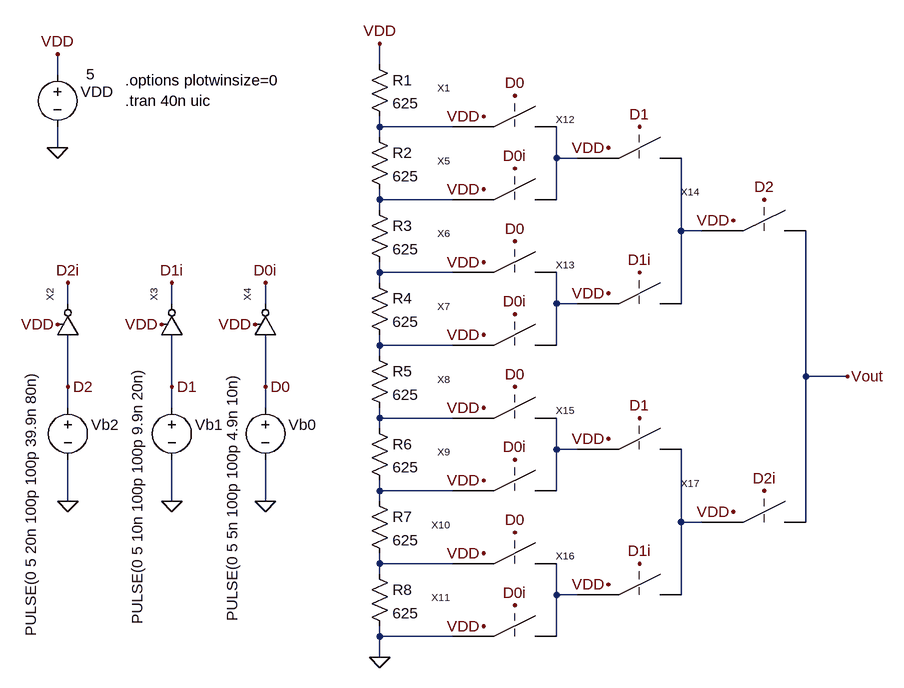
[diagram p0: schematic Fig29_3.asc]
Fig29_3.asc, the LTspice schematic file:
Version 4
SHEET 1 1608 932
WIRE 816 0 816 -32
WIRE 320 16 320 -16
WIRE 816 96 816 80
WIRE 928 96 816 96
WIRE 816 112 816 96
WIRE 320 128 320 96
WIRE 1088 144 1088 96
WIRE 1120 144 1088 144
WIRE 816 208 816 192
WIRE 928 208 816 208
WIRE 1088 208 1088 144
WIRE 816 224 816 208
WIRE 1280 256 1280 144
WIRE 1312 256 1280 256
WIRE 816 320 816 304
WIRE 928 320 816 320
WIRE 816 336 816 320
WIRE 336 368 336 336
WIRE 496 368 496 336
WIRE 640 368 640 336
WIRE 1088 368 1088 320
WIRE 1120 368 1088 368
WIRE 1280 368 1280 256
WIRE 816 432 816 416
WIRE 928 432 816 432
WIRE 1088 432 1088 368
WIRE 816 448 816 432
WIRE 1472 480 1472 256
WIRE 1536 480 1472 480
WIRE 336 496 336 416
WIRE 496 496 496 416
WIRE 640 496 640 416
WIRE 336 528 336 496
WIRE 496 528 496 496
WIRE 640 528 640 496
WIRE 816 544 816 528
WIRE 928 544 816 544
WIRE 816 560 816 544
WIRE 1088 592 1088 544
WIRE 1120 592 1088 592
WIRE 816 656 816 640
WIRE 928 656 816 656
WIRE 1088 656 1088 592
WIRE 336 672 336 608
WIRE 496 672 496 608
WIRE 640 672 640 608
WIRE 816 672 816 656
WIRE 1280 704 1280 592
WIRE 1312 704 1280 704
WIRE 1472 704 1472 480
WIRE 816 768 816 752
WIRE 928 768 816 768
WIRE 816 784 816 768
WIRE 1088 816 1088 768
WIRE 1120 816 1088 816
WIRE 1280 816 1280 704
WIRE 816 880 816 864
WIRE 928 880 816 880
WIRE 1088 880 1088 816
WIRE 816 912 816 880
FLAG 640 672 0
FLAG 1536 480 Vout
FLAG 496 672 0
FLAG 336 672 0
FLAG 320 128 0
FLAG 320 -16 VDD
FLAG 640 496 D0
FLAG 496 496 D1
FLAG 336 496 D2
FLAG 816 912 0
FLAG 816 -32 VDD
FLAG 976 80 VDD
FLAG 320 400 VDD
FLAG 336 336 D2i
FLAG 480 400 VDD
FLAG 496 336 D1i
FLAG 624 400 VDD
FLAG 640 336 D0i
FLAG 1024 48 D0
FLAG 976 192 VDD
FLAG 1024 160 D0i
FLAG 976 304 VDD
FLAG 1024 272 D0
FLAG 976 416 VDD
FLAG 1024 384 D0i
FLAG 976 528 VDD
FLAG 1024 496 D0
FLAG 976 640 VDD
FLAG 1024 608 D0i
FLAG 976 752 VDD
FLAG 1024 720 D0
FLAG 976 864 VDD
FLAG 1024 832 D0i
FLAG 1168 128 VDD
FLAG 1216 96 D1
FLAG 1168 352 VDD
FLAG 1216 320 D1i
FLAG 1360 240 VDD
FLAG 1408 208 D2
FLAG 1168 576 VDD
FLAG 1216 544 D1
FLAG 1168 800 VDD
FLAG 1216 768 D1i
FLAG 1360 688 VDD
FLAG 1408 656 D2i
SYMBOL voltage 640 512 R0
WINDOW 0 36 42 Left 0
WINDOW 3 -51 345 VLeft 0
WINDOW 123 0 0 Left 0
WINDOW 39 0 0 Left 0
SYMATTR InstName Vb0
SYMATTR Value PULSE(0 5 5n 100p 100p 4.9n 10n)
SYMBOL voltage 496 512 R0
WINDOW 0 36 42 Left 0
WINDOW 3 -53 350 VLeft 0
WINDOW 123 0 0 Left 0
WINDOW 39 0 0 Left 0
SYMATTR InstName Vb1
SYMATTR Value PULSE(0 5 10n 100p 100p 9.9n 20n)
SYMBOL voltage 336 512 R0
WINDOW 0 36 42 Left 0
WINDOW 3 -57 368 VLeft 0
WINDOW 123 0 0 Left 0
WINDOW 39 0 0 Left 0
SYMATTR InstName Vb2
SYMATTR Value PULSE(0 5 20n 100p 100p 39.9n 80n)
SYMBOL voltage 320 0 R0
WINDOW 0 36 42 Left 0
WINDOW 3 44 15 Left 0
WINDOW 123 0 0 Left 0
WINDOW 39 0 0 Left 0
SYMATTR InstName VDD
SYMATTR Value 5
SYMBOL res 800 -16 R0
SYMATTR InstName R1
SYMATTR Value 625
SYMBOL res 800 96 R0
SYMATTR InstName R2
SYMATTR Value 625
SYMBOL res 800 208 R0
SYMATTR InstName R3
SYMATTR Value 625
SYMBOL res 800 320 R0
SYMATTR InstName R4
SYMATTR Value 625
SYMBOL res 800 432 R0
SYMATTR InstName R5
SYMATTR Value 625
SYMBOL res 800 544 R0
SYMATTR InstName R6
SYMATTR Value 625
SYMBOL res 800 656 R0
SYMATTR InstName R7
SYMATTR Value 625
SYMBOL res 800 768 R0
SYMATTR InstName R8
SYMATTR Value 625
SYMBOL switch_1 1088 112 M0
SYMATTR InstName X1
SYMBOL inverter 336 416 R270
SYMATTR InstName X2
SYMBOL inverter 496 416 R270
SYMATTR InstName X3
SYMBOL inverter 640 416 R270
SYMATTR InstName X4
SYMBOL switch_1 1088 224 M0
SYMATTR InstName X5
SYMBOL switch_1 1088 336 M0
SYMATTR InstName X6
SYMBOL switch_1 1088 448 M0
SYMATTR InstName X7
SYMBOL switch_1 1088 560 M0
SYMATTR InstName X8
SYMBOL switch_1 1088 672 M0
SYMATTR InstName X9
SYMBOL switch_1 1088 784 M0
SYMATTR InstName X10
SYMBOL switch_1 1088 896 M0
SYMATTR InstName X11
SYMBOL switch_1 1280 160 M0
SYMATTR InstName X12
SYMBOL switch_1 1280 384 M0
SYMATTR InstName X13
SYMBOL switch_1 1472 272 M0
SYMATTR InstName X14
SYMBOL switch_1 1280 608 M0
SYMATTR InstName X15
SYMBOL switch_1 1280 832 M0
SYMATTR InstName X16
SYMBOL switch_1 1472 720 M0
SYMATTR InstName X17
TEXT 424 56 Left 0 !.tran 40n uic
TEXT 424 24 Left 0 !.options plotwinsize=0

The netlist it stands for:
* Fig29_3.asc
Vb0 D0 0 PULSE(0 5 5n 100p 100p 4.9n 10n)
Vb1 D1 0 PULSE(0 5 10n 100p 100p 9.9n 20n)
Vb2 D2 0 PULSE(0 5 20n 100p 100p 39.9n 80n)
VDD VDD 0 5
R1 VDD N001 625
R2 N001 N003 625
R3 N003 N005 625
R4 N005 N007 625
R5 N007 N008 625
R6 N008 N010 625
R7 N010 N012 625
R8 N012 0 625
XX1 N002 N001 D0 VDD switch_1  ; pins P1 P2 clk VDD
XX2 D2 D2i VDD inverter  ; pins In Out VDD
XX3 D1 D1i VDD inverter  ; pins In Out VDD
XX4 D0 D0i VDD inverter  ; pins In Out VDD
XX5 N002 N003 D0i VDD switch_1  ; pins P1 P2 clk VDD
XX6 N006 N005 D0 VDD switch_1  ; pins P1 P2 clk VDD
XX7 N006 N007 D0i VDD switch_1  ; pins P1 P2 clk VDD
XX8 N009 N008 D0 VDD switch_1  ; pins P1 P2 clk VDD
XX9 N009 N010 D0i VDD switch_1  ; pins P1 P2 clk VDD
XX10 N013 N012 D0 VDD switch_1  ; pins P1 P2 clk VDD
XX11 N013 0 D0i VDD switch_1  ; pins P1 P2 clk VDD
XX12 N004 N002 D1 VDD switch_1  ; pins P1 P2 clk VDD
XX13 N004 N006 D1i VDD switch_1  ; pins P1 P2 clk VDD
XX14 Vout N004 D2 VDD switch_1  ; pins P1 P2 clk VDD
XX15 N011 N009 D1 VDD switch_1  ; pins P1 P2 clk VDD
XX16 N011 N013 D1i VDD switch_1  ; pins P1 P2 clk VDD
XX17 Vout N011 D2i VDD switch_1  ; pins P1 P2 clk VDD
.tran 40n uic
.options plotwinsize=0
.backanno
.end